# Altium schematic sheet Battery_Charger.SchDoc
size A4; SheetNumber: 10; SheetTotal: 13
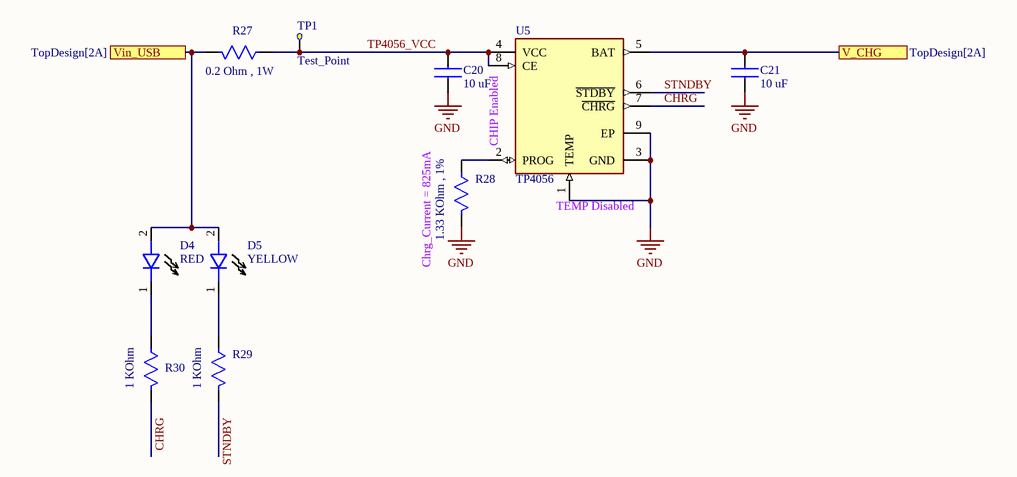
[diagram p0: Battery_Charger.SchDoc]

## Parts
C20  10 uF  [CAP_0603]
C21  10 uF  [CAP_0603]
D4  RED  [LED SMD 0603]
D5  YELLOW  [LED SMD 0603]
R27  0.2 Ohm , 1W  [RES_2512]
R28  1.33 KOhm , 1%  [Res_0603]
R29  1 KOhm  [Res_0603]
R30  1 KOhm  [Res_0603]
TP1  Test_Point  [Test_Point]
U5  TP4056  [TP4056-SOP-8-EP]

## Ports
V_CHG (see TopDesign[2A]), Vin_USB (see TopDesign[2A])

## Nets
GND: C20.1 C21.1 R28.1 U5.1(TEMP) U5.3(GND) U5.9(EP)
CHRG: R30.1 U5.7(~{CHRG})
STNDBY: R29.1 U5.6(~{STDBY})
TP4056_VCC: C20.2 R27.2 TP1.TP?(Ref_Point) U5.4(VCC) U5.8(CE)
V_CHG: C21.2 U5.5(BAT) ; port V_CHG
Vin_USB: D4.2 D5.2 R27.1 ; port Vin_USB
NetD4_1: D4.1 R30.2
NetD5_1: D5.1 R29.2
NetR28_2: R28.2 U5.2(PROG)

## Notes on the sheet
- (near U5) CHIP Enabled
- (near U5) TEMP Disabled
- (near R28) Chrg_Current = 825mA

## Library data of the parts
C20 C21 = Cap_SMD_New: Cap Ceramic 1uF 10V X5R 10% Pad SMD 0402 85C T/R; Manufacturer_Name: SAMSUNG; Manufacturer_Part_Number: CL05A105KP5NNNC; Geometry.Height: 0.55mm; Mouser Part Number: 187-CL05A105KP5NNNC; Mouser Price/Stock: https://www.mouser.co.uk/ProductDetail/Samsung-Electro-Mechanics/CL05A105KP5NNNC?qs=X6jEic%2FHinBsUeNeR9HD7w%3D%3D; Arrow Part Number: CL05A105KP5NNNC; Arrow Price/Stock: https://www.arrow.com/en/products/cl05a105kp5nnnc/samsung-electro-mechanics?region=nac; Datasheet Link: https://www.arrow.com/en/products/cl05a105kp5nnnc/samsung-electro-mechanics
D4 D5 = LED SMD: SMD LED
R27-R30 = Res smd: SMD Resistor; MP: RC0805FR-07330RL; MF: Yageo; Package: 2012 Rohm Semiconductor; Value: *; SnapEDA_Link: https://www.snapeda.com/parts/RC0805FR-07330RL/Yageo/view-part/106115/?ref=snap; Price: None; Availability: Unavailable
U5 = TP4056: Complete single cell Li-Ion battery with a constant current / constant voltage linear charger(SOP 8); MFPN: TP4056; Datasheet: https://dlnmh9ip6v2uc.cloudfront.net/datasheets/Prototyping/TP4056.pdf; LCSC: C7473158